# EAGLE design Roboteq IO Board V2 (EAGLE 7.7.0)

## Sheet 1 of 2
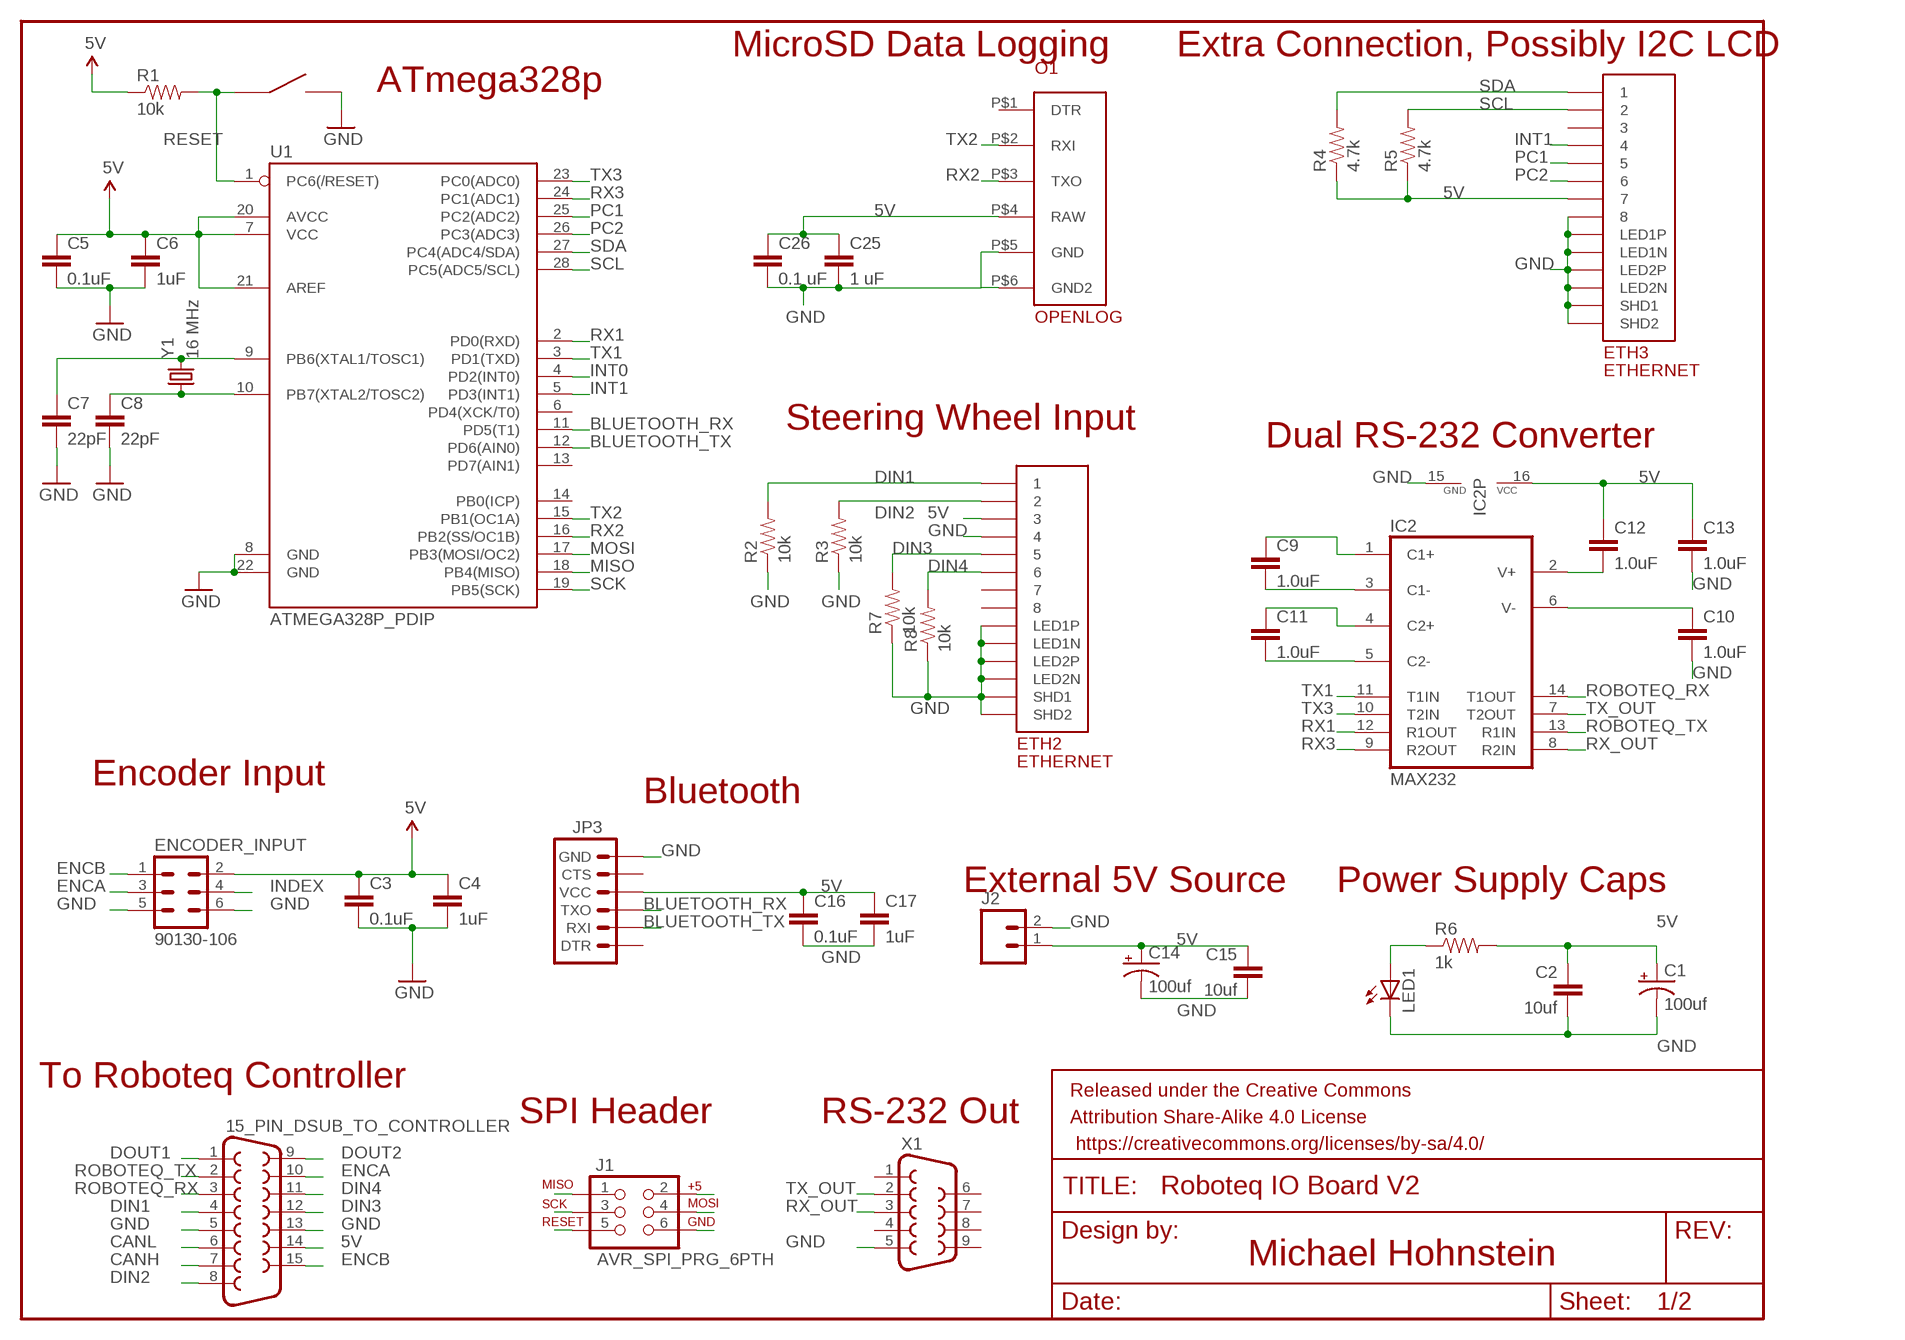
[diagram p0: schematic, sheet 1]

### Parts
15_PIN_DSUB_TO_CONTROLLER  F15HP  [F15HP]
C1  100uf  CAP_POLC  [PANASONIC_C]
C2  10uf  CAP0805  [0805]
C3  0.1uF  CAP0805  [0805]
C4  1uF  CAP0805  [0805]
C5  0.1uF  CAP0805  [0805]
C6  1uF  CAP0805  [0805]
C7  22pF  CAP0805  [0805]
C8  22pF  CAP0805  [0805]
C9  1.0uF  CAP0805  [0805]
C10  1.0uF  CAP0805  [0805]
C11  1.0uF  CAP0805  [0805]
C12  1.0uF  CAP0805  [0805]
C13  1.0uF  CAP0805  [0805]
C14  100uf  CAP_POLC  [PANASONIC_C]
C15  10uf  CAP0805  [0805]
C16  0.1uF  CAP0805  [0805]
C17  1uF  CAP0805  [0805]
C25  1 uF  CAP0805  [0805]
C26  0.1 uF  CAP0805  [0805]
ENCODER_INPUT  90130-106  [90130-1?06]
ETH2  ETHERNET  [A122645-ND]
ETH3  ETHERNET  [A122645-ND]
FRAME2  FRAME-LETTER  [CREATIVE_COMMONS]
IC2  MAX232  [DIL16]
J1  AVR_SPI_PRG_6PTH  [2X3]
J2  M02PTH  [1X02]
JP3  ARDUINO_SERIAL_PROGRAMPTH  [1X06]
LED1  LEDCHIP-LED0805  [CHIP-LED0805]
O1  OPENLOG  [OPENLOG]
R1  10k  RESISTOR0805-RES  [0805]
R2  10k  RESISTOR0805-RES  [0805]
R3  10k  RESISTOR0805-RES  [0805]
R4  4.7k  RESISTOR0805-RES  [0805]
R5  4.7k  RESISTOR0805-RES  [0805]
R6  1k  RESISTOR0805-RES  [0805]
R7  10k  RESISTOR0805-RES  [0805]
R8  10k  RESISTOR0805-RES  [0805]
U1  ATMEGA328P_PDIP  [DIL28-3]
U$3  EG4621CT-ND  [EG4621CT-ND]
X1  F09HP  [F09HP]
Y1  16 MHz  CRYSTALHC49US  [HC49US]

### Nets
5V: 15_PIN_DSUB_TO_CONTROLLER.14 C1.+ C2.1 C3.1 C4.1 C5.1 C6.1 C12.1 C13.1 C14.+ C15.1 C16.1 C17.1 C25.1 C26.1 ENCODER_INPUT.2 ETH2.P$3 ETH3.P$7 IC2.16(VCC) J1.2 J2.1 JP3.4(VCC) O1.P$4(RAW) R1.1 R4.1 R5.1 R6.2 U1.7(VCC) U1.20(AVCC) U1.21(AREF) ; also sheet 2
BLUETOOTH_RX: JP3.3(TXO) U1.11(PD5(T1))
BLUETOOTH_TX: JP3.2(RXI) U1.12(PD6(AIN0))
CANH: 15_PIN_DSUB_TO_CONTROLLER.7
CANL: 15_PIN_DSUB_TO_CONTROLLER.6
DIN1: 15_PIN_DSUB_TO_CONTROLLER.4 ETH2.P$1 R2.2
DIN2: 15_PIN_DSUB_TO_CONTROLLER.8 ETH2.P$2 R3.2
DIN3: 15_PIN_DSUB_TO_CONTROLLER.12 ETH2.P$5 R7.2
DIN4: 15_PIN_DSUB_TO_CONTROLLER.11 ETH2.P$6 R8.2
DOUT1: 15_PIN_DSUB_TO_CONTROLLER.1
DOUT2: 15_PIN_DSUB_TO_CONTROLLER.9
ENCA: 15_PIN_DSUB_TO_CONTROLLER.10 ENCODER_INPUT.3
ENCB: 15_PIN_DSUB_TO_CONTROLLER.15 ENCODER_INPUT.1
GND: 15_PIN_DSUB_TO_CONTROLLER.5 15_PIN_DSUB_TO_CONTROLLER.13 C1.- C2.2 C3.2 C4.2 C5.2 C6.2 C7.2 C8.2 C10.2 C13.2 C14.- C15.2 C16.2 C17.2 C25.2 C26.2 ENCODER_INPUT.5 ENCODER_INPUT.6 ETH2.P$4 ETH2.P$9(LED1N) ETH2.P$10(LED1P) ETH2.P$11(LED2N) ETH2.P$12(LED2P) ETH2.P$13(SHD1) ETH2.P$14(SHD2) ETH3.P$8 ETH3.P$9(LED1N) ETH3.P$10(LED1P) ETH3.P$11(LED2N) ETH3.P$12(LED2P) ETH3.P$13(SHD1) ETH3.P$14(SHD2) IC2.15(GND) J1.6 J2.2 JP3.6(GND) LED1.C O1.P$5(GND) O1.P$6(GND2) R2.1 R3.1 R7.1 R8.1 U1.8(GND) U1.22(GND) U$3.P$3 U$3.P$4 X1.5 ; also sheet 2
INDEX: ENCODER_INPUT.4
INT0: U1.4(PD2(INT0)) ; also sheet 2
INT1: ETH3.P$4 U1.5(PD3(INT1))
MISO: J1.1 U1.18(PB4(MISO))
MOSI: J1.4 U1.17(PB3(MOSI/OC2))
N$1: C7.1 U1.9(PB6(XTAL1/TOSC1)) Y1.2
N$2: C8.1 U1.10(PB7(XTAL2/TOSC2)) Y1.1
N$3: C9.1 IC2.1(C1+)
N$4: C9.2 IC2.3(C1-)
N$5: LED1.A R6.1
N$6: C10.1 IC2.6(V-)
N$7: C11.1 IC2.4(C2+)
N$8: C11.2 IC2.5(C2-)
N$10: C12.2 IC2.2(V+)
PC1: ETH3.P$5 U1.25(PC2(ADC2))
PC2: ETH3.P$6 U1.26(PC3(ADC3))
RESET: J1.5 R1.2 U1.1(PC6(/RESET)) U$3.P$1 U$3.P$2
ROBOTEQ_RX: 15_PIN_DSUB_TO_CONTROLLER.3 IC2.14(T1OUT)
ROBOTEQ_TX: 15_PIN_DSUB_TO_CONTROLLER.2 IC2.13(R1IN)
RX1: IC2.12(R1OUT) U1.2(PD0(RXD))
RX2: O1.P$3(TXO) U1.16(PB2(SS/OC1B))
RX3: IC2.9(R2OUT) U1.24(PC1(ADC1))
RX_OUT: IC2.8(R2IN) X1.3
SCK: J1.3 U1.19(PB5(SCK))
SCL: ETH3.P$2 R5.2 U1.28(PC5(ADC5/SCL))
SDA: ETH3.P$1 R4.2 U1.27(PC4(ADC4/SDA))
TX1: IC2.11(T1IN) U1.3(PD1(TXD))
TX2: O1.P$2(RXI) U1.15(PB1(OC1A))
TX3: IC2.10(T2IN) U1.23(PC0(ADC0))
TX_OUT: IC2.7(T2OUT) X1.2
Unconnected: ETH2.P$7 ETH2.P$8 ETH3.P$3 JP3.1(DTR) JP3.5(CTS) O1.P$1(DTR) U1.6(PD4(XCK/T0)) U1.13(PD7(AIN1)) U1.14(PB0(ICP)) X1.1 X1.4 X1.6 X1.7 X1.8 X1.9

### Notes on the sheet
- MicroSD Data Logging | Extra Connection, Possibly I2C LCD
- ATmega328p
- Steering Wheel Input
- Dual RS-232 Converter
- Encoder Input
- Bluetooth
- External 5V Source | Power Supply Caps
- To Roboteq Controller
- SPI Header | RS-232 Out
- Michael Hohnstein

## Sheet 2 of 2
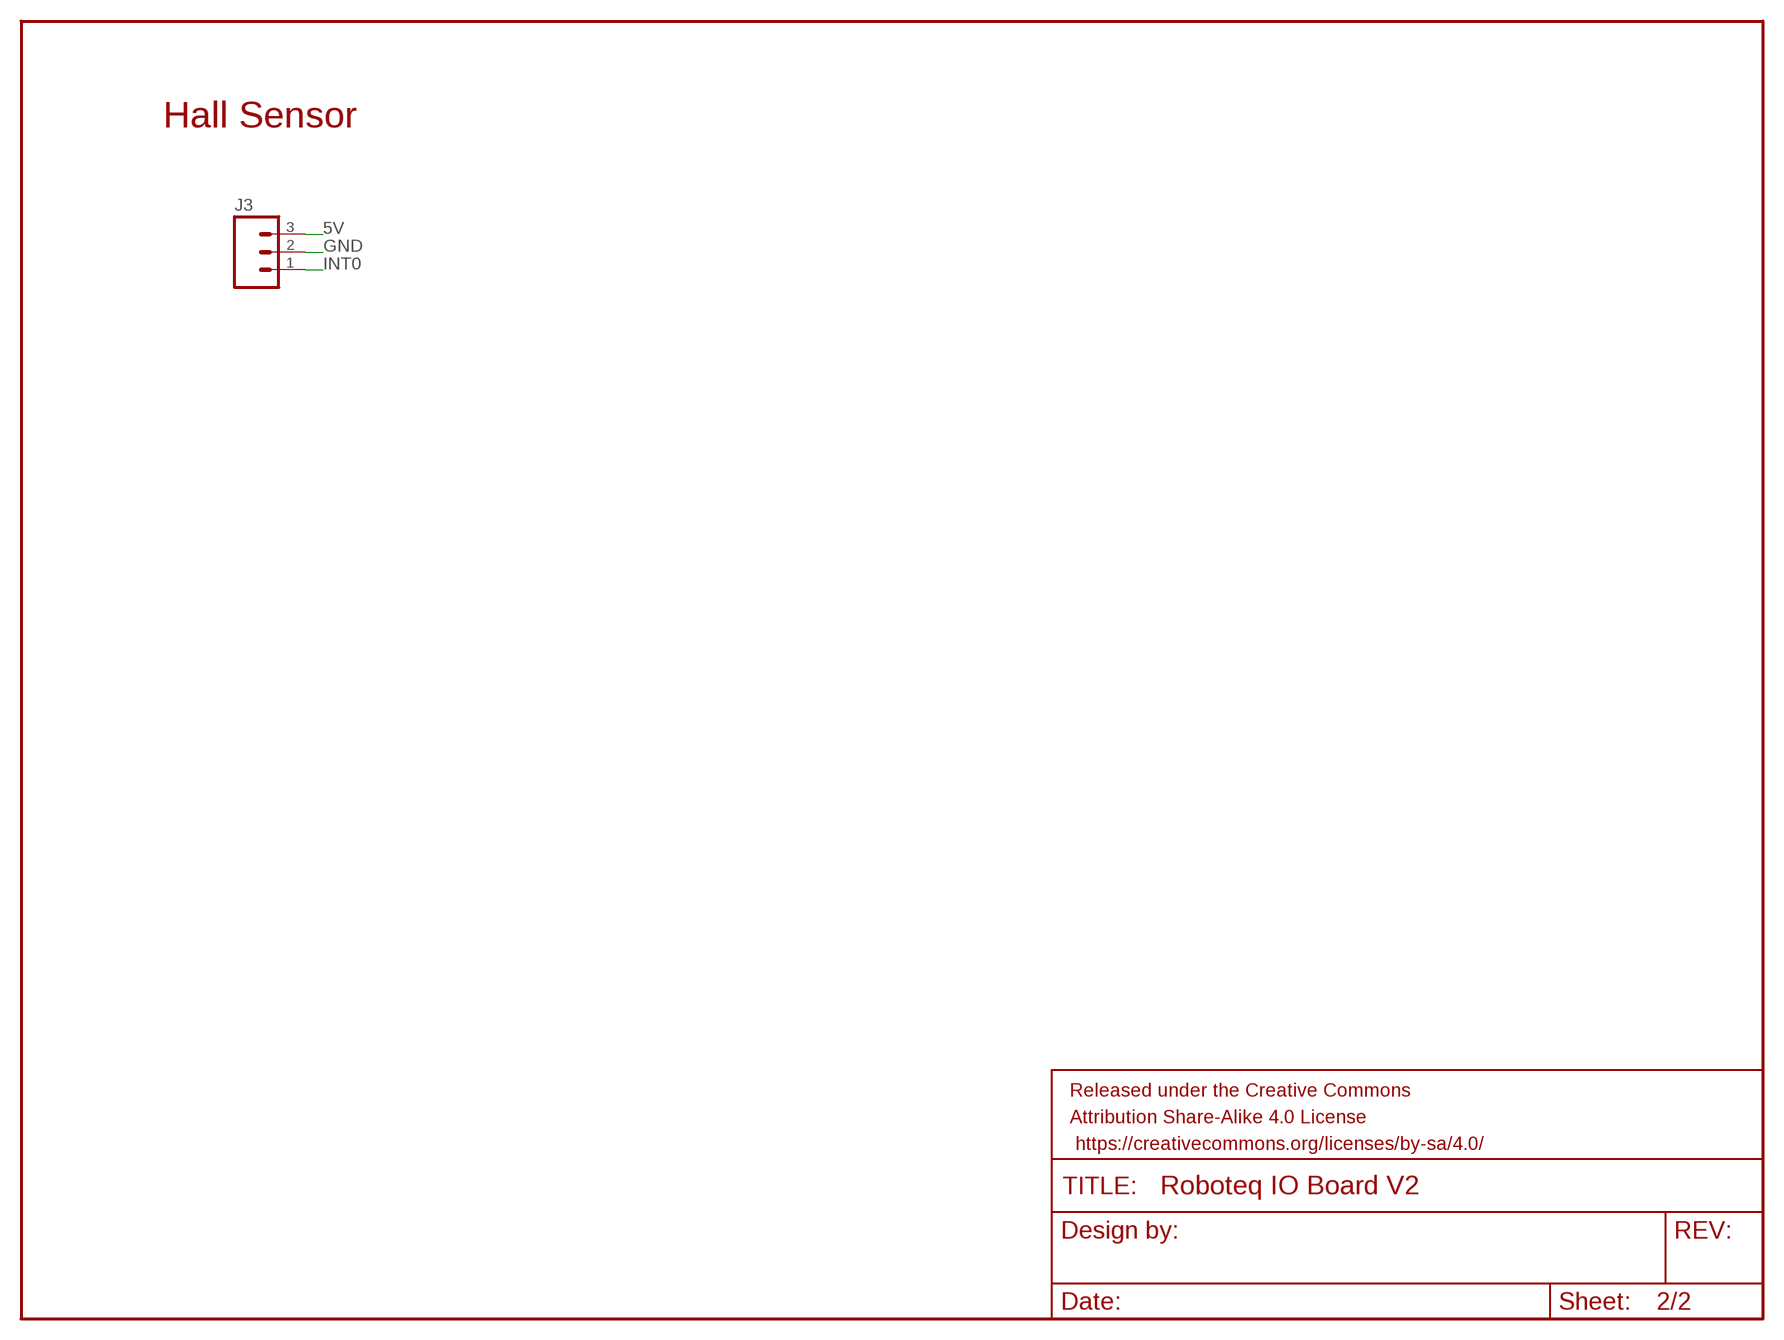
[diagram p1: schematic, sheet 2]

### Parts
FRAME1  FRAME-LETTER  [CREATIVE_COMMONS]
J3  M03PTH  [1X03]

### Nets
5V: J3.3 ; also sheet 1
GND: J3.2 ; also sheet 1
INT0: J3.1 ; also sheet 1

### Notes on the sheet
- Hall Sensor

## Library data of the parts
15_PIN_DSUB_TO_CONTROLLER = con-subd:F15: SUB-D; OC_FARNELL: unknown; OC_NEWARK: unknown
C1 C14 = SparkFun-Capacitors:CAP_POL: Capacitor Polarized These are standard SMD and PTH capacitors. Normally 10uF, 47uF, and 100uF in electrolytic and tantalum varieties. Always verify the external diameter of the through hole cap, it varies with capacity, voltage, and manufacturer. The EIA devices should be standard.
C2-C6 C9-C13 C15-C17 C25 C26 = SparkFun-Capacitors:CAP: Capacitor Standard 0603 ceramic capacitor, and 0.1" leaded capacitor.
C7 C8 = SparkFun-Passives:CAP: Capacitor Standard 0603 ceramic capacitor, and 0.1" leaded capacitor.
ENCODER_INPUT = con-molex-c-grid:90130-1?06: C-Grid III
ETH2 ETH3 = ETHERNET:ETHERNET: Ethernet port with 2 leds. digikey number A122645-ND
FRAME1 FRAME2 = SparkFun-Aesthetics:FRAME-LETTER: Schematic Frame Standard 8.5x11 US Letter frame
IC2 = maxim:MAX232: RS232 TRANSCEIVER; MF: MAXIM; MPN: MAX232ACPE+; OC_FARNELL: 9723773; OC_NEWARK: 68K4544
J1 = SparkFun-Connectors:AVR_SPI_PRG_6: AVR ISP 6 Pin This is the reduced ISP connector for AVR programming. Common on Arduino. This footprint will take up less PCB space and can be used with a 10-pin to 6-pin adapter such as SKU: BOB-08508 **Special note about "TEST_POINT" package. The stop mask is on the top side, so if you want your programming test points to be on the bottom of your board, make sure to place this package on the bottom side of the board. This also ensure that the orientation to program from the bottom side will be correct.
J2 = SparkFun-Connectors:M02: Standard 2-pin 0.1" header. Use with - straight break away headers ( PRT-00116) - right angle break away headers (PRT-00553) - swiss pins (PRT-00743) - machine pins (PRT-00117) - female headers (PRT-00115) Molex polarized connector foot print use with: PRT-08233 with associated crimp pins and housings. 2.54_SCREWTERM for use with PRT-10571. 3.5mm Screw Terminal footprints for PRT-08084 5mm Screw Terminal footprints for use with PRT-08432
J3 = SparkFun-Connectors:M03: Header 3 Standard 3-pin 0.1" header. Use with straight break away headers (SKU : PRT-00116), right angle break away headers (PRT-00553), swiss pins (PRT-00743), machine pins (PRT-00117), and female headers (PRT-00115). Molex polarized connector foot print use with SKU : PRT-08232 with associated crimp pins and housings.
JP3 = SparkFun:ARDUINO_SERIAL_PROGRAM
LED1 = led:LED: LED OSRAM: - CHIPLED LG R971, LG N971, LY N971, LG Q971, LY Q971, LO R971, LY R971 LH N974, LH R974 LS Q976, LO Q976, LY Q976 LO Q996 - Hyper CHIPLED LW Q18S LB Q993, LB Q99A, LB R99A - SideLED LS A670, LO A670, LY A670, LG A670, LP A670 LB A673, LV A673, LT A673, LW A673 LH A674 LY A675 LS A676, LA A676, LO A676, LY A676, LW A676 LS A679, LY A679, LG A679 - Hyper Micro SIDELED® LS Y876, LA Y876, LO Y876, LY Y876 LT Y87S - SmartLED LW L88C, LW L88S LB L89C, LB L89S, LG L890 LS L89K, LO L89K, LY L89K LS L896, LA L896, LO L896, LY L896 - TOPLED LS T670, LO T670, LY T670, LG T670, LP T670 LSG T670, LSP T670, LSY T670, LOP T670, LYG T670 LG T671, LOG T671, LSG T671 LB T673, LV T673, LT T673, LW T673 LH T674 LS T676, LA T676, LO T676, LY T676, LB T676, LH T676, LSB T676, LW T676 LB T67C, LV T67C, LT T67C, LS T67K, LO T67K, LY T67K, LW E67C LS E67B, LA E67B, LO E67B, LY E67B, LB E67C, LV E67C, LT E67C LW T67C LS T679, LY T679, LG T679 LS T770, LO T770, LY T770, LG T770, LP T770 LB T773, LV T773, LT T773, LW T773 LH T774 LS E675, LA E675, LY E675, LS T675 LS T776, LA T776, LO T776, LY T776, LB T776 LHGB T686 LT T68C, LB T68C - Hyper Mini TOPLED® LB M676 - Mini TOPLED Santana® LG M470 LS M47K, LO M47K, LY M47K Source: http://www.osram.convergy.de LUXEON: - LUMILED® LXK2-PW12-R00, LXK2-PW12-S00, LXK2-PW14-U00, LXK2-PW14-V00 LXK2-PM12-R00, LXK2-PM12-S00, LXK2-PM14-U00 LXK2-PE12-Q00, LXK2-PE12-R00, LXK2-PE12-S00, LXK2-PE14-T00, LXK2-PE14-U00 LXK2-PB12-K00, LXK2-PB12-L00, LXK2-PB12-M00, LXK2-PB14-N00, LXK2-PB14-P00, LXK2-PB14-Q00 LXK2-PR12-L00, LXK2-PR12-M00, LXK2-PR14-Q00, LXK2-PR14-R00 LXK2-PD12-Q00, LXK2-PD12-R00, LXK2-PD12-S00 LXK2-PH12-R00, LXK2-PH12-S00 LXK2-PL12-P00, LXK2-PL12-Q00, LXK2-PL12-R00 Source: www.luxeon.com KINGBRIGHT: KA-3528ASYC Source: www.kingbright.com
O1 = openlog:OPENLOG
R1-R8 = SparkFun-Resistors:RESISTOR: Resistor Basic schematic elements and footprints for 0603, 1206, and PTH resistors.
U1 = SparkFun-DigitalIC:ATMEGA328P_PDIP: uC used in the Arduino 32kb flash, 1k EEPROM, 2k SRAM This is the through-hole version of this chip.
U$3 = EG4621CT-ND:EG4621CT-ND: surface mount push putton digikey number EG4621CT-ND
X1 = con-subd:F09: SUB-D; OC_FARNELL: unknown; OC_NEWARK: unknown
Y1 = SparkFun-FreqCtrl:CRYSTAL: Various standard crystals. Proven footprints.

## Board
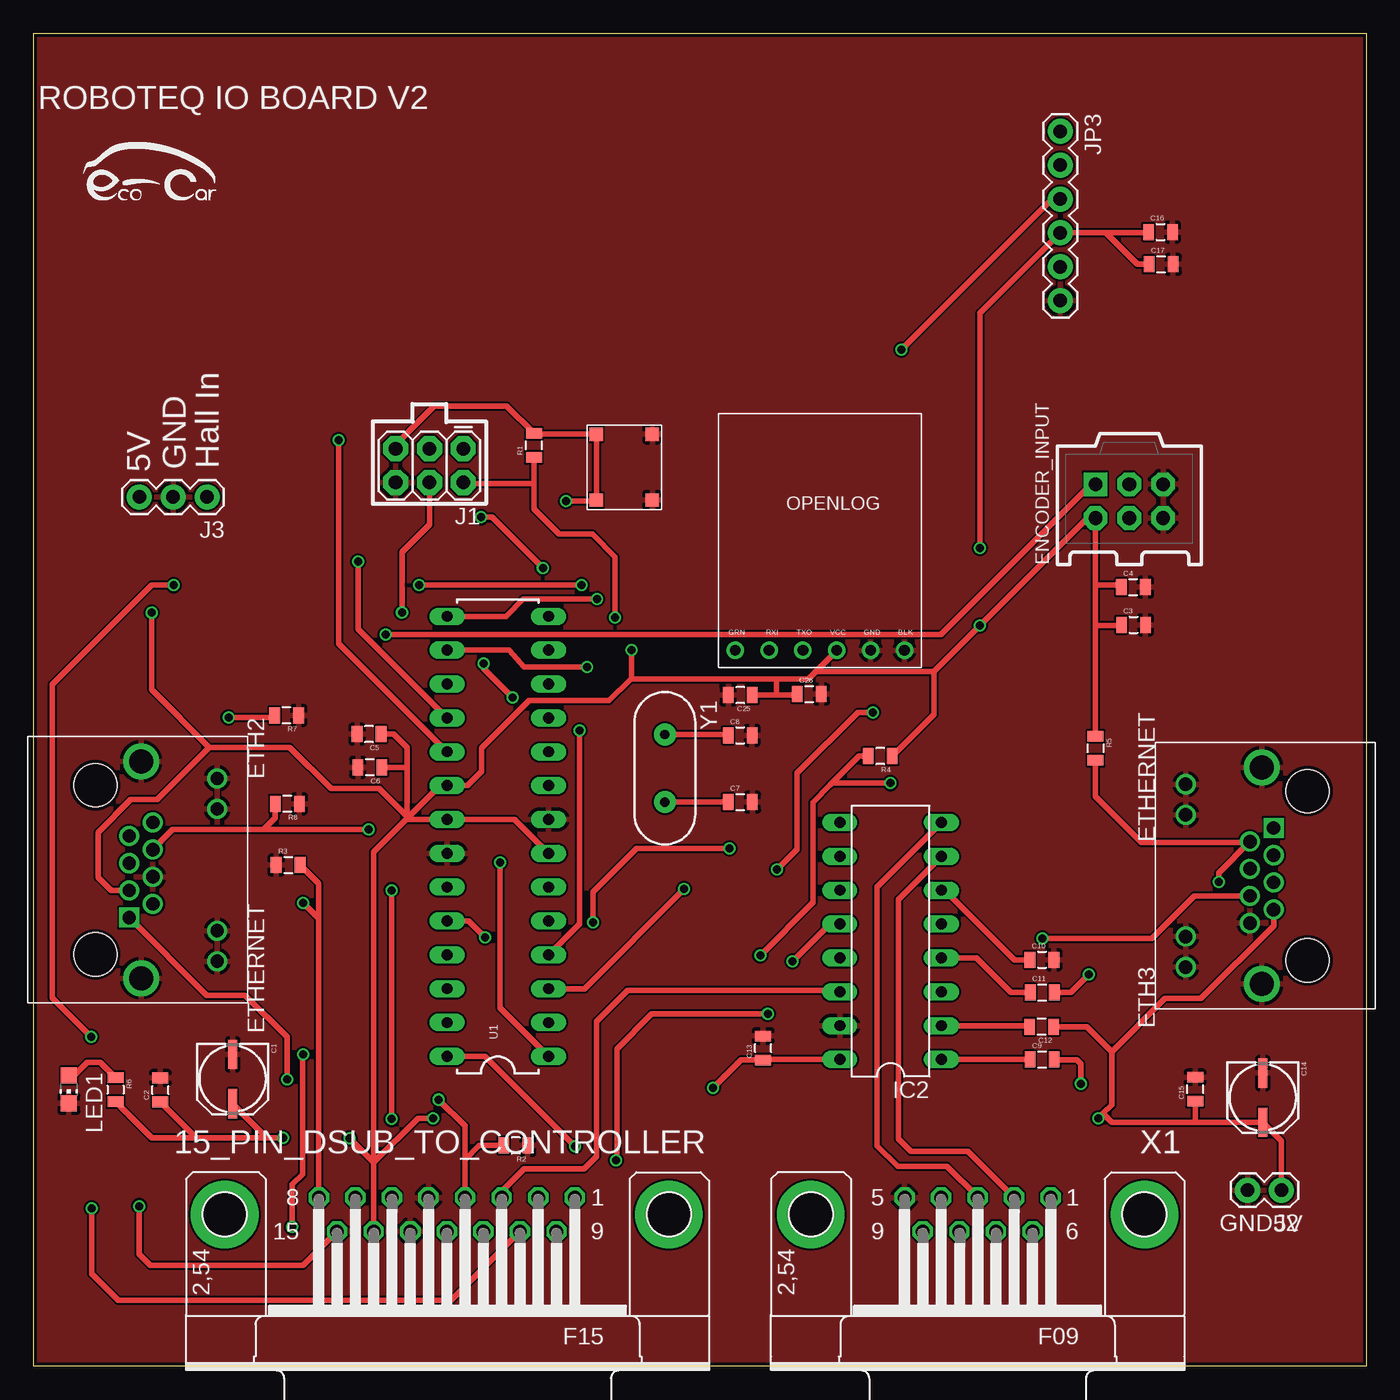
[diagram p2: board, top side]
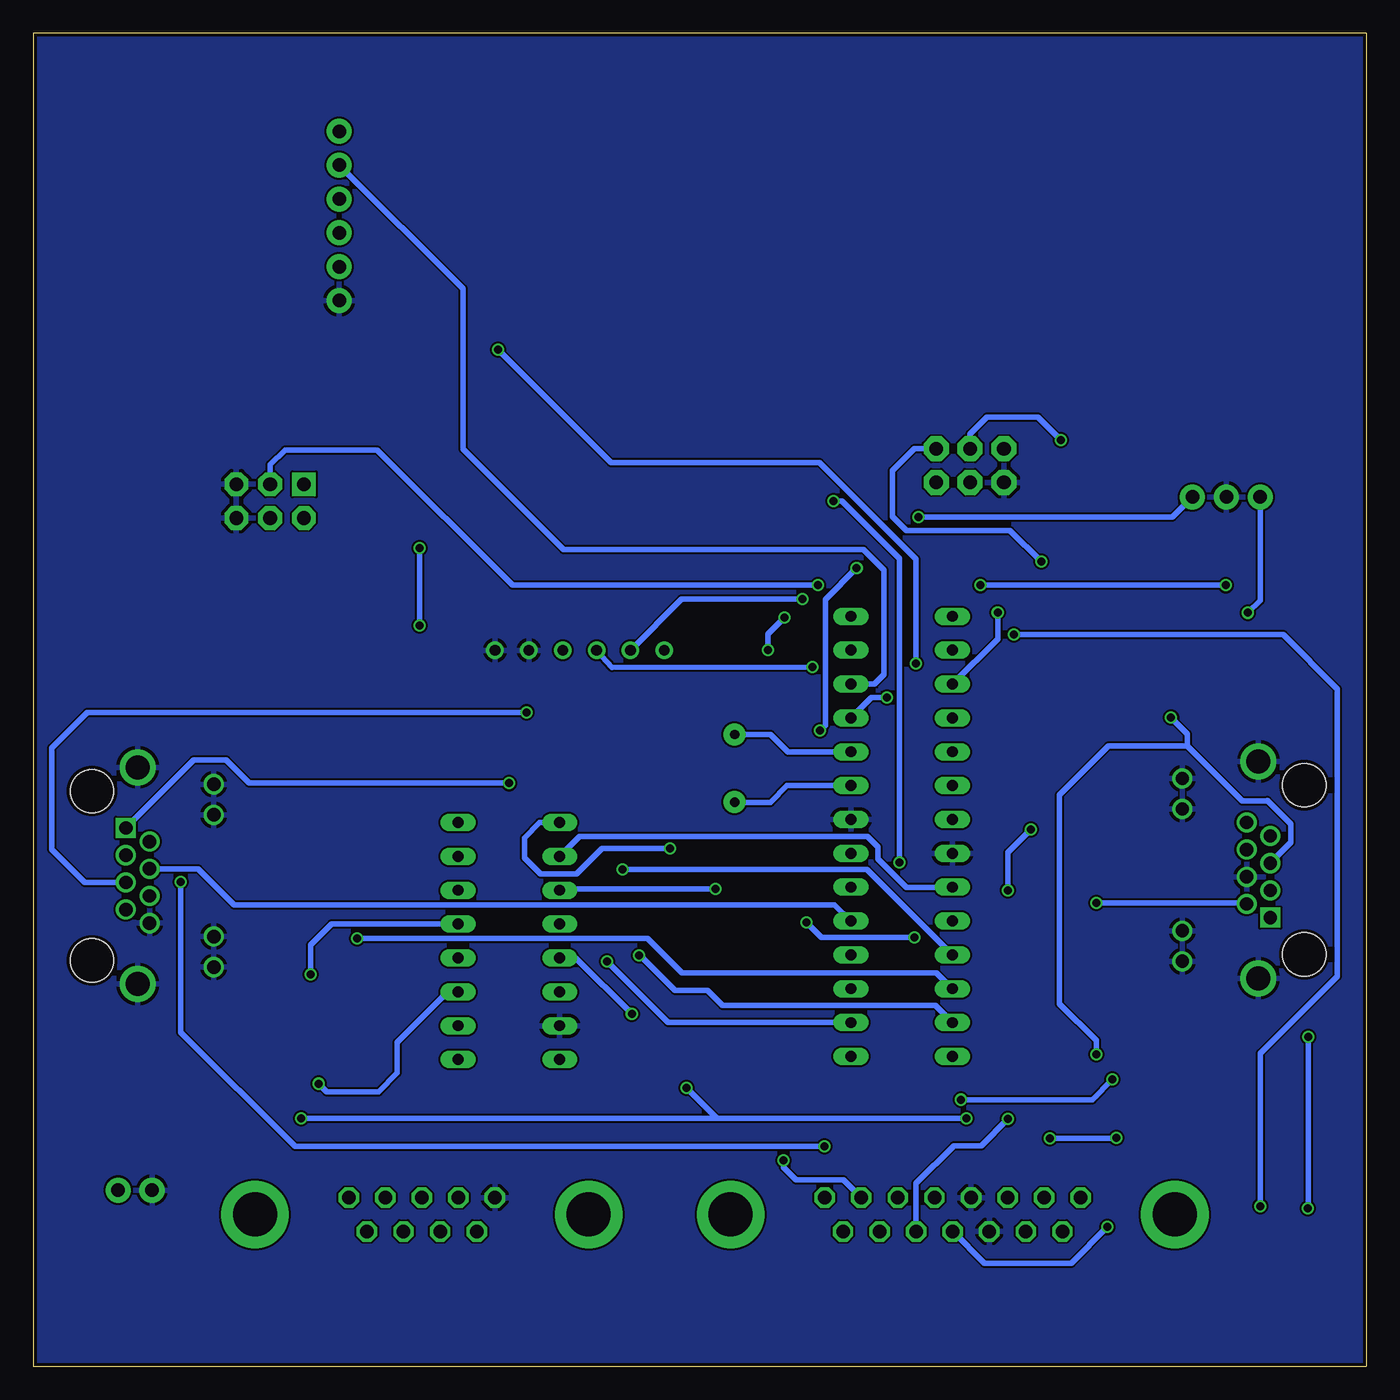
[diagram p3: board, bottom side, seen from below]

Size 100 x 100 mm. Coordinates in mm from the lower left corner, seen from the top.
Outline: 0,100 0,0 100,0 100,100 0,100
Copper layers (1*16): Top 0.035mm / dielectric 1.5mm / Bottom 0.035mm
Design rules "SeeedStudio_2layer_DRU_no_angle_20140221": minimum track width 6mil, minimum drill 12mil, track to track 6mil, track to pad 6mil, pad to pad 6mil, via to via 6mil, smd to smd 0mil, copper to edge 10mil, drill to drill 10mil, minimum pad ring 10mil, minimum via ring 6mil, stop-mask expansion 2mil, vias tented up to drill 100mil, thermal gap 10mil

### Footprints (pad centres in the part's own frame; a part is rotated, then mirrored left to right if it is on the bottom)
F15HP = drill 1.016 octagon: 1 -9.601,-1.27; 2 -6.858,-1.27; 3 -4.115,-1.27; 4 -1.372,-1.27; 5 1.372,-1.27; 6 4.115,-1.27; 7 6.858,-1.27; 8 9.601,-1.27; 9 -8.23,1.27; 10 -5.486,1.27; 11 -2.743,1.27; 12 0,1.27; 13 2.743,1.27; 14 5.486,1.27; 15 8.23,1.27 | drill 3.302 pad 5.08: G1 -16.662,0; G2 16.662,0
PANASONIC_C = smd 2.2 x 0.65: + 1.9,-0.2; - -1.8,-0.2
0805 = smd 0.8 x 1.2: 1 -0.9,0; 2 0.9,0
90130-1?06 = drill 1.016 pad 1.778 square: 1 -2.54,1.27 | drill 1.016 pad 1.778 octagon: 2 -2.54,-1.27; 3 0,1.27; 4 0,-1.27; 5 2.54,1.27; 6 2.54,-1.27
A122645-ND = drill 1 square: P$1 3.58,2.54 | drill 1: P$2 2.56,4.32; P$3 1.54,2.54; P$4 0.52,4.32; P$5 -0.5,2.54; P$6 -1.52,4.32; P$7 -2.54,2.54; P$8 -3.56,4.32; P$9 -6.86,9.14; P$10 -4.57,9.14; P$11 4.57,9.14; P$12 6.86,9.14 | drill 1.8: P$13 -8.13,3.43; P$14 8.13,3.43 | hole 3.25: -6.35,0; 6.35,0
DIL16 = drill 0.813 long: 1 -8.89,-3.81; 2 -6.35,-3.81; 3 -3.81,-3.81; 4 -1.27,-3.81; 5 1.27,-3.81; 6 3.81,-3.81; 7 6.35,-3.81; 8 8.89,-3.81; 9 8.89,3.81; 10 6.35,3.81; 11 3.81,3.81; 12 1.27,3.81; 13 -1.27,3.81; 14 -3.81,3.81; 15 -6.35,3.81; 16 -8.89,3.81
2X3 = drill 1.016 pad 1.88 octagon: 1 0,0; 2 0,2.54; 3 2.54,0; 4 2.54,2.54; 5 5.08,0; 6 5.08,2.54
1X02 = drill 1.016 pad 1.88: 1 0,0; 2 2.54,0
1X03 = drill 1.016 pad 1.88: 1 0,0; 2 2.54,0; 3 5.08,0
1X06 = drill 1.016 pad 1.88: 1 0,0; 2 2.54,0; 3 5.08,0; 4 7.62,0; 5 10.16,0; 6 12.7,0
CHIP-LED0805 = smd 1.2 x 1.2: A 0,-1.05; C 0,1.05
OPENLOG = drill 0.8: P$1 -6.35,-8.255; P$2 -3.81,-8.255; P$3 -1.27,-8.255; P$4 1.27,-8.255; P$5 3.81,-8.255; P$6 6.35,-8.255
DIL28-3 = drill 0.813 long: 1 -16.51,-3.81; 2 -13.97,-3.81; 3 -11.43,-3.81; 4 -8.89,-3.81; 5 -6.35,-3.81; 6 -3.81,-3.81; 7 -1.27,-3.81; 8 1.27,-3.81; 9 3.81,-3.81; 10 6.35,-3.81; 11 8.89,-3.81; 12 11.43,-3.81; 13 13.97,-3.81; 14 16.51,-3.81; 15 16.51,3.81; 16 13.97,3.81; 17 11.43,3.81; 18 8.89,3.81; 19 6.35,3.81; 20 3.81,3.81; 21 1.27,3.81; 22 -1.27,3.81; 23 -3.81,3.81; 24 -6.35,3.81; 25 -8.89,3.81; 26 -11.43,3.81; 27 -13.97,3.81; 28 -16.51,3.81
EG4621CT-ND = smd 1 x 1: P$1 -2.475,2.1; P$2 2.475,2.1; P$3 -2.475,-2.1; P$4 2.475,-2.1
F09HP = drill 1.016 octagon: 1 -5.486,-1.27; 2 -2.743,-1.27; 3 0,-1.27; 4 2.743,-1.27; 5 5.486,-1.27; 6 -4.115,1.27; 7 -1.372,1.27; 8 1.372,1.27; 9 4.115,1.27 | drill 3.302 pad 5.08: G1 -12.522,0; G2 12.522,0
HC49US = drill 0.7 pad 1.651: 1 -2.54,0; 2 2.54,0

### Placement (x,y rotation side)
15_PIN_DSUB_TO_CONTROLLER  31.02,11.38 180 top
C1  15.15,21.59 270 top
C2  9.53,20.73 90 top
C3  82.54,55.62 0 top
C4  82.53,58.44 0 top
C5  25.19,47.42 180 top
C6  25.25,44.92 180 top
C7  53.04,42.32 0 top
C8  53.03,47.32 0 top
C9  75.69,23.01 0 top
C10  75.67,30.49 0 top
C11  75.7,28.04 0 top
C12  75.65,25.47 180 top
C13  54.76,23.87 90 top
C14  92.44,20.19 270 top
C15  87.18,20.78 90 top
C16  84.57,85.1 0 top
C17  84.61,82.67 0 top
C25  53.04,50.35 180 top
C26  58.22,50.42 0 top
ENCODER_INPUT  82.23,64.9 0 top
ETH2  4.65,37.24 270 top
ETH3  95.6,36.8 90 top
FRAME1  -101.6,-21.47 0 top  (outside the outline)
FRAME2  -101.6,86.36 0 top  (outside the outline)
IC2  64.32,31.9 90 top
J1  32.26,68.84 180 top
J2  93.64,13.21 180 top
J3  13.03,65.21 180 top
JP3  77.05,92.65 270 top
LED1  2.67,20.76 180 top
O1  59.01,61.96 0 top
R1  37.55,69.09 90 top
R2  36.19,16.56 180 top
R3  19.12,37.6 0 top
R4  63.54,45.77 180 top
R5  79.69,46.36 270 top
R6  6.17,20.75 270 top
R7  19,48.83 180 top
R8  19.05,42.2 180 top
U1  34.85,39.75 90 top
U$3  44.34,67.45 90 top
U$16  [LOGO]  9.14,89.24 0 top
X1  70.85,11.38 180 top
Y1  47.38,44.86 270 top

### Tracks (layer width: path | path; a pad name or v marks a point on that pad's centre or on a via)
5V  (via drill 0.6)
  Top 0.406: U1.7 36.12,41.02 U1.21 28.25,41.02 | 15_PIN_DSUB_TO_CONTROLLER.14 25.53,15.29 | 25.53,15.29 25.53,38.58 27.97,41.02 | 27.97,41.02 28.25,41.02 | C1.+ 17.51,17.13 | 17.51,17.13 v18.75,17.13 | v23.73,17.09 25.53,15.29 | C2.1 12.23,17.13 | 12.23,17.13 17.51,17.13 | R6.2 8.89,17.13 12.23,17.13 | ETH2.P$3 5.84,35.7 4.87,36.67 4.87,40.06 7.32,42.51 9.28,42.51 13.2,46.43 | C12.1 79.03,25.47 80.9,23.6 | 80.9,23.6 80.9,19.6 80.25,18.95 | 80.25,18.95 v79.9,18.6 | v30,18.6 v29.99,18.61 28.86,18.61 25.53,15.29 | v51,20.89 53.08,22.97 C13.1 54.8,23.01 IC2.16 | 80.9,23.6 84.88,27.58 87.61,27.58 93.06,33.03 ETH3.P$7 | 27.97,41.02 30.51,43.56 U1.20 32.58,43.56 33.63,44.61 33.63,46.37 37.2,49.94 43.21,49.94 44.84,51.57 | O1.P$4 58.7,52.13 | 55.77,51.57 58.15,51.57 58.7,52.13 | 55.77,51.57 44.84,51.57 | 67.57,52.13 v71.01,55.57 79.07,63.63 ENCODER_INPUT.2 79.69,58.59 | 67.57,52.13 58.7,52.13 | 79.69,58.59 79.69,55.57 | 79.69,55.57 R5.1 | v44.87,53.73 44.87,51.6 44.84,51.57 | 37.52,68.16 R1.1 37.55,66.21 | 37.55,66.21 37.55,64.31 39.44,62.42 41.95,62.42 43.65,60.72 v43.65,56.16 | 55.77,51.57 55.77,50.35 | 55.77,50.35 C25.1 | C26.1 57.32,50.35 55.77,50.35 | 67.57,52.13 67.57,48.9 R4.1 | 27.95,41.32 25.93,43.34 22.33,43.34 19.24,46.43 13.2,46.43 | 27.95,41.32 28.25,41.02 | C6.1 28.05,44.92 | 28.05,44.92 28.05,41.42 27.95,41.32 | C5.1 27.02,47.42 28.03,46.41 28.03,44.94 28.05,44.92 | J1.2 32.35,66.21 37.55,66.21 | C4.1 81.48,58.59 79.69,58.59 | C3.1 81.59,55.57 79.69,55.57 | J2.1 93.64,16.89 C14.+ 87.13,18.29 | 87.13,18.29 80.92,18.29 80.25,18.95 | C15.1 87.18,18.34 87.13,18.29 | v71.01,61.39 71.01,78.99 JP3.4 80.48,85.03 | 80.48,85.03 83.67,85.03 C16.1
  Top 0.406: C17.1 82.84,82.67 80.48,85.03 | 13.2,46.43 8.87,50.76 v8.87,56.53
  Bottom 0.406: v18.75,17.13 18.79,17.09 v23.73,17.09 | v79.9,18.6 48.71,18.6 | 48.71,18.6 v30,18.6 | v51,20.89 48.71,18.6 | v44.87,53.73 44.87,54.94 v43.65,56.16 | v71.01,61.39 v71.01,55.57 | v8.87,56.53 7.95,57.45 J3.3
BLUETOOTH_RX  (via drill 0.6)
  Top 0.406: v35.97,50.17 33.78,52.36 v33.78,52.73 | v65.13,76.27 76.43,87.57 JP3.3
  Bottom 0.406: U1.11 37.13,50.17 v35.97,50.17 | v33.78,52.73 33.78,60.56 41.01,67.79 56.65,67.79 v65.13,76.27
BLUETOOTH_TX
  Bottom 0.406: U1.12 36.9,51.18 36.18,51.9 36.18,59.72 37.72,61.26 60.22,61.26 67.77,68.81 67.77,80.83 JP3.2
DIN1  (via drill 0.6)
  Top 0.406: 15_PIN_DSUB_TO_CONTROLLER.4 32.39,15.49 | 32.39,15.49 32.39,18.03 v30.42,20 | v19.04,21.51 19.04,24.7 15.91,27.83 13.02,27.83 ETH2.P$1 | R2.2 33.46,16.56 32.39,15.49
  Bottom 0.406: v30.42,20 20.55,20 v19.04,21.51
DIN2  (via drill 0.6)
  Top 0.406: 15_PIN_DSUB_TO_CONTROLLER.8 21.42,32.73 21.42,33.59 | 21.42,33.59 v20.24,34.77 | R3.2 21.42,36.2 21.42,33.59
  Bottom 0.406: v20.24,34.77 9.06,34.77 ETH2.P$2
DIN3  (via drill 0.6)
  Top 0.406: v20.24,23.39 20.19,23.34 20.19,14.41 19.41,13.63 v19.41,10.44 | v14.64,48.66 17.93,48.66 R7.2
  Bottom 0.406: ETH2.P$5 5.64,39.29 5.64,40.67 7.42,42.45 7.47,42.4 9.29,42.4 13.41,46.52 | 13.41,46.52 19.36,46.52 23.01,42.87 23.01,27.2 20.24,24.43 v20.24,23.39 | v19.41,10.44 22.12,7.73 28.64,7.73 15_PIN_DSUB_TO_CONTROLLER.12 | 13.41,46.52 13.41,47.43 v14.64,48.66
DIN4  (via drill 0.6)
  Top 0.406: v26.87,18.54 v26.87,35.71 | v25.15,40.26 17.27,40.26 | 17.27,40.26 10.47,40.26 ETH2.P$6 | R8.2 18.15,41.14 17.27,40.26
  Bottom 0.406: 15_PIN_DSUB_TO_CONTROLLER.11 33.76,13.73 30.94,16.55 28.86,16.55 v26.87,18.54 | v26.87,35.71 26.87,38.54 v25.15,40.26
ENCA  (via drill 0.6)
  Top 0.406: 15_PIN_DSUB_TO_CONTROLLER.10 31.36,4.96 6.37,4.96 4.38,6.95 v4.38,11.85 | v4.33,24.72 1.43,27.62 1.43,51.15 8.87,58.59 v10.52,58.59 | v28.94,58.59 v41.12,58.59
  Bottom 0.406: v4.38,11.85 4.33,11.9 v4.33,24.72 | v10.52,58.59 v28.94,58.59 | v41.12,58.59 64.04,58.59 74.2,68.75 81.11,68.75 82.23,67.63 ENCODER_INPUT.3
ENCB  (via drill 0.6)
  Top 0.406: 15_PIN_DSUB_TO_CONTROLLER.15 20.26,7.58 8.75,7.58 7.94,8.39 v7.94,12.01 | v26.43,54.88 68.09,54.88 79.38,66.17 ENCODER_INPUT.1
  Bottom 0.406: v7.94,12.01 7.94,23.47 2.16,29.25 2.16,50.82 6.22,54.88 v26.43,54.88
GND
  pour Bottom: -10,110 110,110 110,-10 -10,-10
  pour Top: -10,110 110,110 110,-10 -10,-10
INT0  (via drill 0.6)
  Top 0.406: U1.4 40.97,33.17 v40.97,47.69 | v38.23,59.87 34.41,63.69 v33.61,63.69
  Bottom 0.406: v33.61,63.69 14.55,63.69 J3.1 | v40.97,47.69 40.58,48.08 40.58,57.52 v38.23,59.87
INT1
  Bottom 0.406: U1.5 39.88,34.62 84.92,34.62 87.62,37.32 ETH3.P$4
MISO  (via drill 0.6)
  Top 0.406: U1.18 24.37,55.31 v24.37,60.36
  Bottom 0.406: v24.37,60.36 26.72,62.71 34.49,62.71 35.53,63.75 35.53,67.2 33.89,68.84 J1.1
MOSI  (via drill 0.6)
  Top 0.406: v27.65,56.55 27.65,61.09 29.72,63.16 J1.4
  Bottom 0.406: U1.17 27.65,54.57 v27.65,56.55
N$1
  Top 0.406: Y1.2 C7.1
  Bottom 0.406: U1.9 43.44,43.56 44.7,42.3 47.36,42.3 Y1.2
N$2
  Top 0.406: Y1.1 52.05,47.4 C8.1
  Bottom 0.406: U1.10 43.4,46.1 44.7,47.4 Y1.1
N$3
  Top 0.406: IC2.1 C9.1
N$4  (via drill 0.6)
  Top 0.406: v78.6,21.2 78.6,22.7 78.3,23 C9.2
  Bottom 0.406: IC2.3 68.91,28.09 72.7,24.3 72.7,22 74.1,20.6 78,20.6 v78.6,21.2
N$5
  Top 0.406: R6.1 5.02,22.8 4.05,22.8 3.06,21.81 LED1.A
N$6
  Top 0.406: IC2.6 68.39,35.71 73.61,30.49 C10.1
N$7
  Top 0.406: IC2.4 70.77,30.63 73.36,28.04 C11.1
N$8  (via drill 0.6)
  Top 0.406: v79.2,29.4 77.84,28.04 C11.2
  Bottom 0.406: IC2.5 77.63,33.17 79.2,31.6 v79.2,29.4
N$10
  Top 0.406: IC2.2 74.67,25.55 C12.2
PC1  (via drill 0.6)
  Top 0.406: v55.8,37.28 57.3,38.78 57.3,44.49 61.87,49.06 v63,49.06
  Bottom 0.406: U1.25 37.46,37.28 v55.8,37.28 | v63,49.06 95.94,49.06 98.61,46.39 98.61,38.78 96.13,36.3 ETH3.P$5
PC2  (via drill 0.6)
  Top 0.406: v75.71,32.08 83.91,32.08 87.11,35.28 ETH3.P$6
  Bottom 0.406: U1.26 32.23,29.51 51.35,29.51 53.92,32.08 v75.71,32.08
RESET  (via drill 0.6)
  Top 0.406: U1.1 35.01,26.89 v35.01,37.78 | v39.97,64.91 42.17,64.91 U$3.P$1 U$3.P$2 37.62,69.92 R1.2 35.51,72.03 30.05,72.03 27.18,69.16 J1.5
  Bottom 0.406: v35.01,37.78 35.01,60.59 39.33,64.91 v39.97,64.91
ROBOTEQ_RX
  Top 0.406: 15_PIN_DSUB_TO_CONTROLLER.3 35.13,13.11 36.82,14.79 41.33,14.79 42.27,15.73 42.27,25.88 44.59,28.2 60.4,28.2 IC2.14
ROBOTEQ_TX  (via drill 0.6)
  Top 0.406: v43.72,15.45 43.78,15.51 43.78,23.81 46.39,26.42 v55.1,26.42
  Bottom 0.406: 15_PIN_DSUB_TO_CONTROLLER.2 39.22,13.99 42.79,13.99 43.72,14.92 v43.72,15.45 | v55.1,26.42 59.31,30.63 IC2.13
RX1  (via drill 0.6)
  Top 0.406: v56.96,30.36 59.77,33.17 IC2.12
  Bottom 0.406: U1.2 52.38,25.78 v56.96,30.36
RX2  (via drill 0.6)
  Top 0.406: U1.16 35.68,53.72 36.81,52.47 v41.55,52.47
  Bottom 0.406: v41.55,52.47 56.59,52.43 O1.P$3
RX3  (via drill 0.6)
  Top 0.406: v52.24,38.85 45.25,38.85 41.99,35.59 v41.99,33.29 | v33.89,32.17 32.66,33.4 U1.24
  Bottom 0.406: v52.24,38.85 57.32,38.85 59.24,36.93 61.95,36.93 63.15,38.13 63.15,39.65 62.01,40.79 IC2.9 | v41.99,33.29 40.87,32.17 v33.89,32.17
RX_OUT
  Top 0.406: IC2.8 63.29,35.95 63.29,16.55 64.85,14.99 68.56,14.99 70.85,12.7 X1.3
SCK  (via drill 0.6)
  Top 0.406: U1.19 22.91,54.23 v22.91,69.49
  Bottom 0.406: v22.91,69.49 24.64,71.22 28.44,71.22 29.72,69.94 J1.3
SCL  (via drill 0.6)
  Top 0.406: U1.28 33.88,23.24 v40.64,16.48 | v88.93,36.34 88.93,37.01 ETH3.P$2 91.2,39.28 83.14,39.28 79.69,42.73 R5.2
  Bottom 0.406: v40.64,16.48 80.35,16.48 88.93,25.06 v88.93,36.34
SDA  (via drill 0.6)
  Top 0.406: v54.54,30.83 58.49,34.78 58.49,42.3 59.78,43.59 59.93,43.74 | 59.93,43.74 v64.31,43.74 | R4.2 61.96,45.77 59.93,43.74
  Bottom 0.406: U1.27 32.33,27.07 48.28,27.07 49.41,28.2 51.85,28.2 54.48,30.83 v54.54,30.83 | v64.31,43.74 83.79,43.74 85.54,45.49 87.95,45.49 ETH3.P$1
TX1  (via drill 0.6)
  Top 0.406: U1.3 41.35,28.32 v48.83,35.8
  Bottom 0.406: v48.83,35.8 60.42,35.8 IC2.11
TX2  (via drill 0.6)
  Top 0.406: U1.15 35.45,56.26 36.74,57.55 v42.28,57.55
  Bottom 0.406: v42.28,57.55 51.35,57.55 O1.P$2
TX3
  Bottom 0.406: IC2.10 59.01,39.75 37.41,39.75 36.64,38.97 36.64,38.06 34.49,35.91 31.07,35.91 U1.23
TX_OUT
  Top 0.406: IC2.7 64.91,35.03 64.91,17.07 65.85,16.13 70.11,16.13 X1.2

### Text on the board
tPlace: ROBOTEQ IO BOARD V2 | 5V | GND | Hall In | GND | 5V